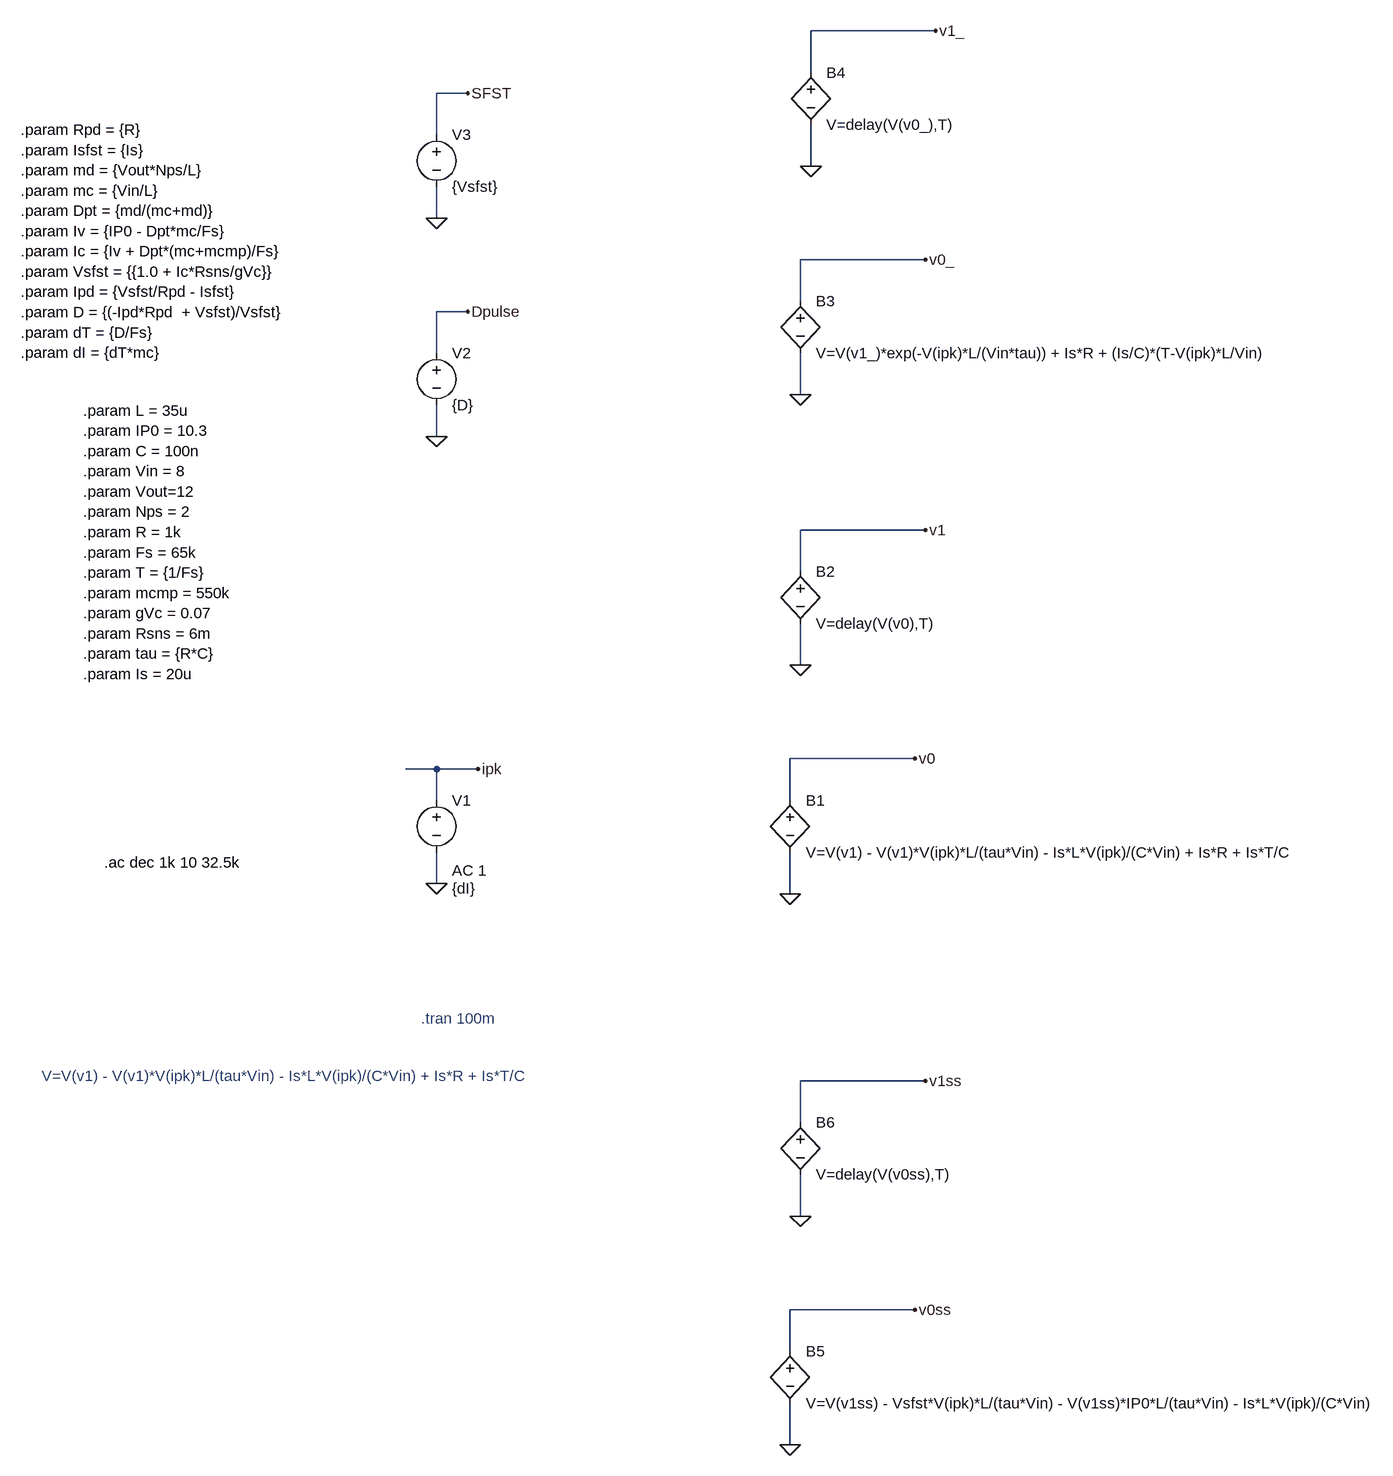
[diagram p0: schematic IPL_Small_Signal_Check.asc]
IPL_Small_Signal_Check.asc, the LTspice schematic file:
Version 4
SHEET 1 1708 1140
WIRE 880 -1056 688 -1056
WIRE 688 -992 688 -1056
WIRE 160 -960 112 -960
WIRE 112 -896 112 -960
WIRE 688 -848 688 -912
WIRE 112 -768 112 -816
WIRE 864 -704 672 -704
WIRE 672 -640 672 -704
WIRE 160 -624 112 -624
WIRE 112 -560 112 -624
WIRE 672 -496 672 -560
WIRE 112 -432 112 -480
WIRE 864 -288 672 -288
WIRE 672 -224 672 -288
WIRE 672 -80 672 -144
WIRE 848 64 656 64
WIRE 112 80 64 80
WIRE 176 80 112 80
WIRE 112 128 112 80
WIRE 656 128 656 64
WIRE 112 256 112 208
WIRE 656 272 656 208
WIRE 864 560 672 560
WIRE 672 624 672 560
WIRE 672 768 672 704
WIRE 848 912 656 912
WIRE 656 976 656 912
WIRE 656 1120 656 1056
FLAG 112 256 0
FLAG 176 80 ipk
FLAG 656 272 0
FLAG 848 64 v0
FLAG 672 -80 0
FLAG 864 -288 v1
FLAG 672 -496 0
FLAG 864 -704 v0_
FLAG 688 -848 0
FLAG 880 -1056 v1_
FLAG 656 1120 0
FLAG 848 912 v0ss
FLAG 672 768 0
FLAG 864 560 v1ss
FLAG 112 -432 0
FLAG 160 -624 Dpulse
FLAG 112 -768 0
FLAG 160 -960 SFST
DATAFLAG 720 -288 ""
DATAFLAG 736 -1056 ""
DATAFLAG 720 560 ""
DATAFLAG 64 80 ""
DATAFLAG 112 -624 ""
DATAFLAG 112 -960 ""
SYMBOL voltage 112 112 R0
WINDOW 3 24 152 Left 2
WINDOW 123 24 124 Left 2
WINDOW 39 0 0 Left 0
SYMATTR InstName V1
SYMATTR Value {dI}
SYMATTR Value2 AC 1
SYMBOL bv 656 112 R0
SYMATTR InstName B1
SYMATTR Value V=V(v1) - V(v1)*V(ipk)*L/(tau*Vin) - Is*L*V(ipk)/(C*Vin) + Is*R + Is*T/C
SYMBOL bv 672 -240 R0
SYMATTR InstName B2
SYMATTR Value V=delay(V(v0),T)
SYMBOL bv 672 -656 R0
SYMATTR InstName B3
SYMATTR Value V=V(v1_)*exp(-V(ipk)*L/(Vin*tau)) + Is*R + (Is/C)*(T-V(ipk)*L/Vin)
SYMBOL bv 688 -1008 R0
SYMATTR InstName B4
SYMATTR Value V=delay(V(v0_),T)
SYMBOL bv 656 960 R0
SYMATTR InstName B5
SYMATTR Value V=V(v1ss) - Vsfst*V(ipk)*L/(tau*Vin) - V(v1ss)*IP0*L/(tau*Vin) - Is*L*V(ipk)/(C*Vin)
SYMBOL bv 672 608 R0
SYMATTR InstName B6
SYMATTR Value V=delay(V(v0ss),T)
SYMBOL voltage 112 -576 R0
SYMATTR InstName V2
SYMATTR Value {D}
SYMBOL voltage 112 -912 R0
SYMATTR InstName V3
SYMATTR Value {Vsfst}
TEXT -432 -472 Left 2 !.param L = 35u\n.param IP0 = 10.3\n.param C = 100n\n.param Vin = 8\n.param Vout=12\n.param Nps = 2\n.param R = 1k\n.param Fs = 65k\n.param T = {1/Fs}\n.param mcmp = 550k\n.param gVc = 0.07\n.param Rsns = 6m\n.param tau = {R*C}\n.param Is = 20u
TEXT 88 464 Left 2 ;.tran 100m
TEXT -496 552 Left 2 ;V=V(v1) - V(v1)*V(ipk)*L/(tau*Vin) - Is*L*V(ipk)/(C*Vin) + Is*R + Is*T/C
TEXT -400 224 Left 2 !.ac dec 1k 10 32.5k
TEXT -528 -904 Left 2 !.param Rpd = {R}\n.param Isfst = {Is}\n.param md = {Vout*Nps/L}\n.param mc = {Vin/L}\n.param Dpt = {md/(mc+md)}\n.param Iv = {IP0 - Dpt*mc/Fs}\n.param Ic = {Iv + Dpt*(mc+mcmp)/Fs}\n.param Vsfst = {{1.0 + Ic*Rsns/gVc}}\n.param Ipd = {Vsfst/Rpd - Isfst}\n.param D = {(-Ipd*Rpd  + Vsfst)/Vsfst}\n.param dT = {D/Fs}\n.param dI = {dT*mc}

The netlist it stands for:
* IPL_Small_Signal_Check.asc
V1 ipk 0 {dI} AC 1
B1 v0 0 V=V(v1) - V(v1)*V(ipk)*L/(tau*Vin) - Is*L*V(ipk)/(C*Vin) + Is*R + Is*T/C
B2 v1 0 V=delay(V(v0),T)
B3 v0_ 0 V=V(v1_)*exp(-V(ipk)*L/(Vin*tau)) + Is*R + (Is/C)*(T-V(ipk)*L/Vin)
B4 v1_ 0 V=delay(V(v0_),T)
B5 v0ss 0 V=V(v1ss) - Vsfst*V(ipk)*L/(tau*Vin) - V(v1ss)*IP0*L/(tau*Vin) - Is*L*V(ipk)/(C*Vin)
B6 v1ss 0 V=delay(V(v0ss),T)
V2 Dpulse 0 {D}
V3 SFST 0 {Vsfst}
.param L = 35u
.param IP0 = 10.3
.param C = 100n
.param Vin = 8
.param Vout=12
.param Nps = 2
.param R = 1k
.param Fs = 65k
.param T = {1/Fs}
.param mcmp = 550k
.param gVc = 0.07
.param Rsns = 6m
.param tau = {R*C}
.param Is = 20u
* .tran 100m
* V=V(v1) - V(v1)*V(ipk)*L/(tau*Vin) - Is*L*V(ipk)/(C*Vin) + Is*R + Is*T/C
.ac dec 1k 10 32.5k
.param Rpd = {R}
.param Isfst = {Is}
.param md = {Vout*Nps/L}
.param mc = {Vin/L}
.param Dpt = {md/(mc+md)}
.param Iv = {IP0 - Dpt*mc/Fs}
.param Ic = {Iv + Dpt*(mc+mcmp)/Fs}
.param Vsfst = {{1.0 + Ic*Rsns/gVc}}
.param Ipd = {Vsfst/Rpd - Isfst}
.param D = {(-Ipd*Rpd  + Vsfst)/Vsfst}
.param dT = {D/Fs}
.param dI = {dT*mc}
.backanno
.end